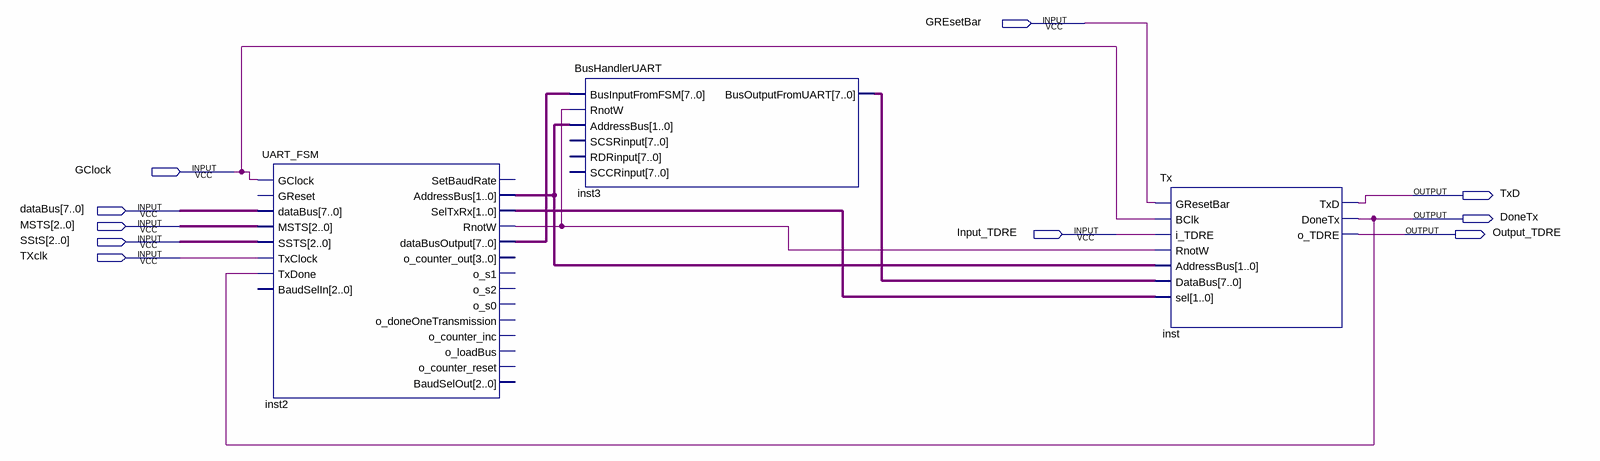
[diagram p0: schematic sheet]
// Quartus schematic Tasinda.bdf as structural Verilog: 3 symbols, 10 pins
module Tasinda (
  input  GREsetBar,
  input  GClock,
  input  [7:0] dataBus,
  input  [2:0] MSTS,
  input  Input_TDRE,
  input  [2:0] SStS,
  input  TXclk,
  output TxD,
  output DoneTx,
  output Output_TDRE
);

  wire inst2_rnotw;
  wire [1:0] inst2_addressbus, inst2_seltxrx;
  wire [7:0] inst2_databusoutput, inst3_busoutputfromuart;

  UART_FSM inst2 (
    .GClock(GClock), .dataBus(dataBus), .MSTS(MSTS), .SSTS(SStS), .TxClock(TXclk), .TxDone(DoneTx),
    .AddressBus(inst2_addressbus), .SelTxRx(inst2_seltxrx), .RnotW(inst2_rnotw),
    .dataBusOutput(inst2_databusoutput));  // open: GReset, BaudSelIn, SetBaudRate, o_counter_out, o_s1, o_s2, o_s0, o_doneOneTransmission, o_counter_inc, o_loadBus, o_counter_reset, BaudSelOut
  BusHandlerUART inst3 (
    .BusInputFromFSM(inst2_databusoutput), .RnotW(inst2_rnotw), .AddressBus(inst2_addressbus),
    .BusOutputFromUART(inst3_busoutputfromuart));  // open: SCSRinput, RDRinput, SCCRinput
  Tx inst (
    .GResetBar(GREsetBar), .BClk(GClock), .i_TDRE(Input_TDRE), .RnotW(inst2_rnotw),
    .AddressBus(inst2_addressbus), .DataBus(inst3_busoutputfromuart), .sel(inst2_seltxrx), .TxD(TxD),
    .DoneTx(DoneTx), .o_TDRE(Output_TDRE));
endmodule
